# EAGLE design ArmCortexM3_breakout (EAGLE 5.11)
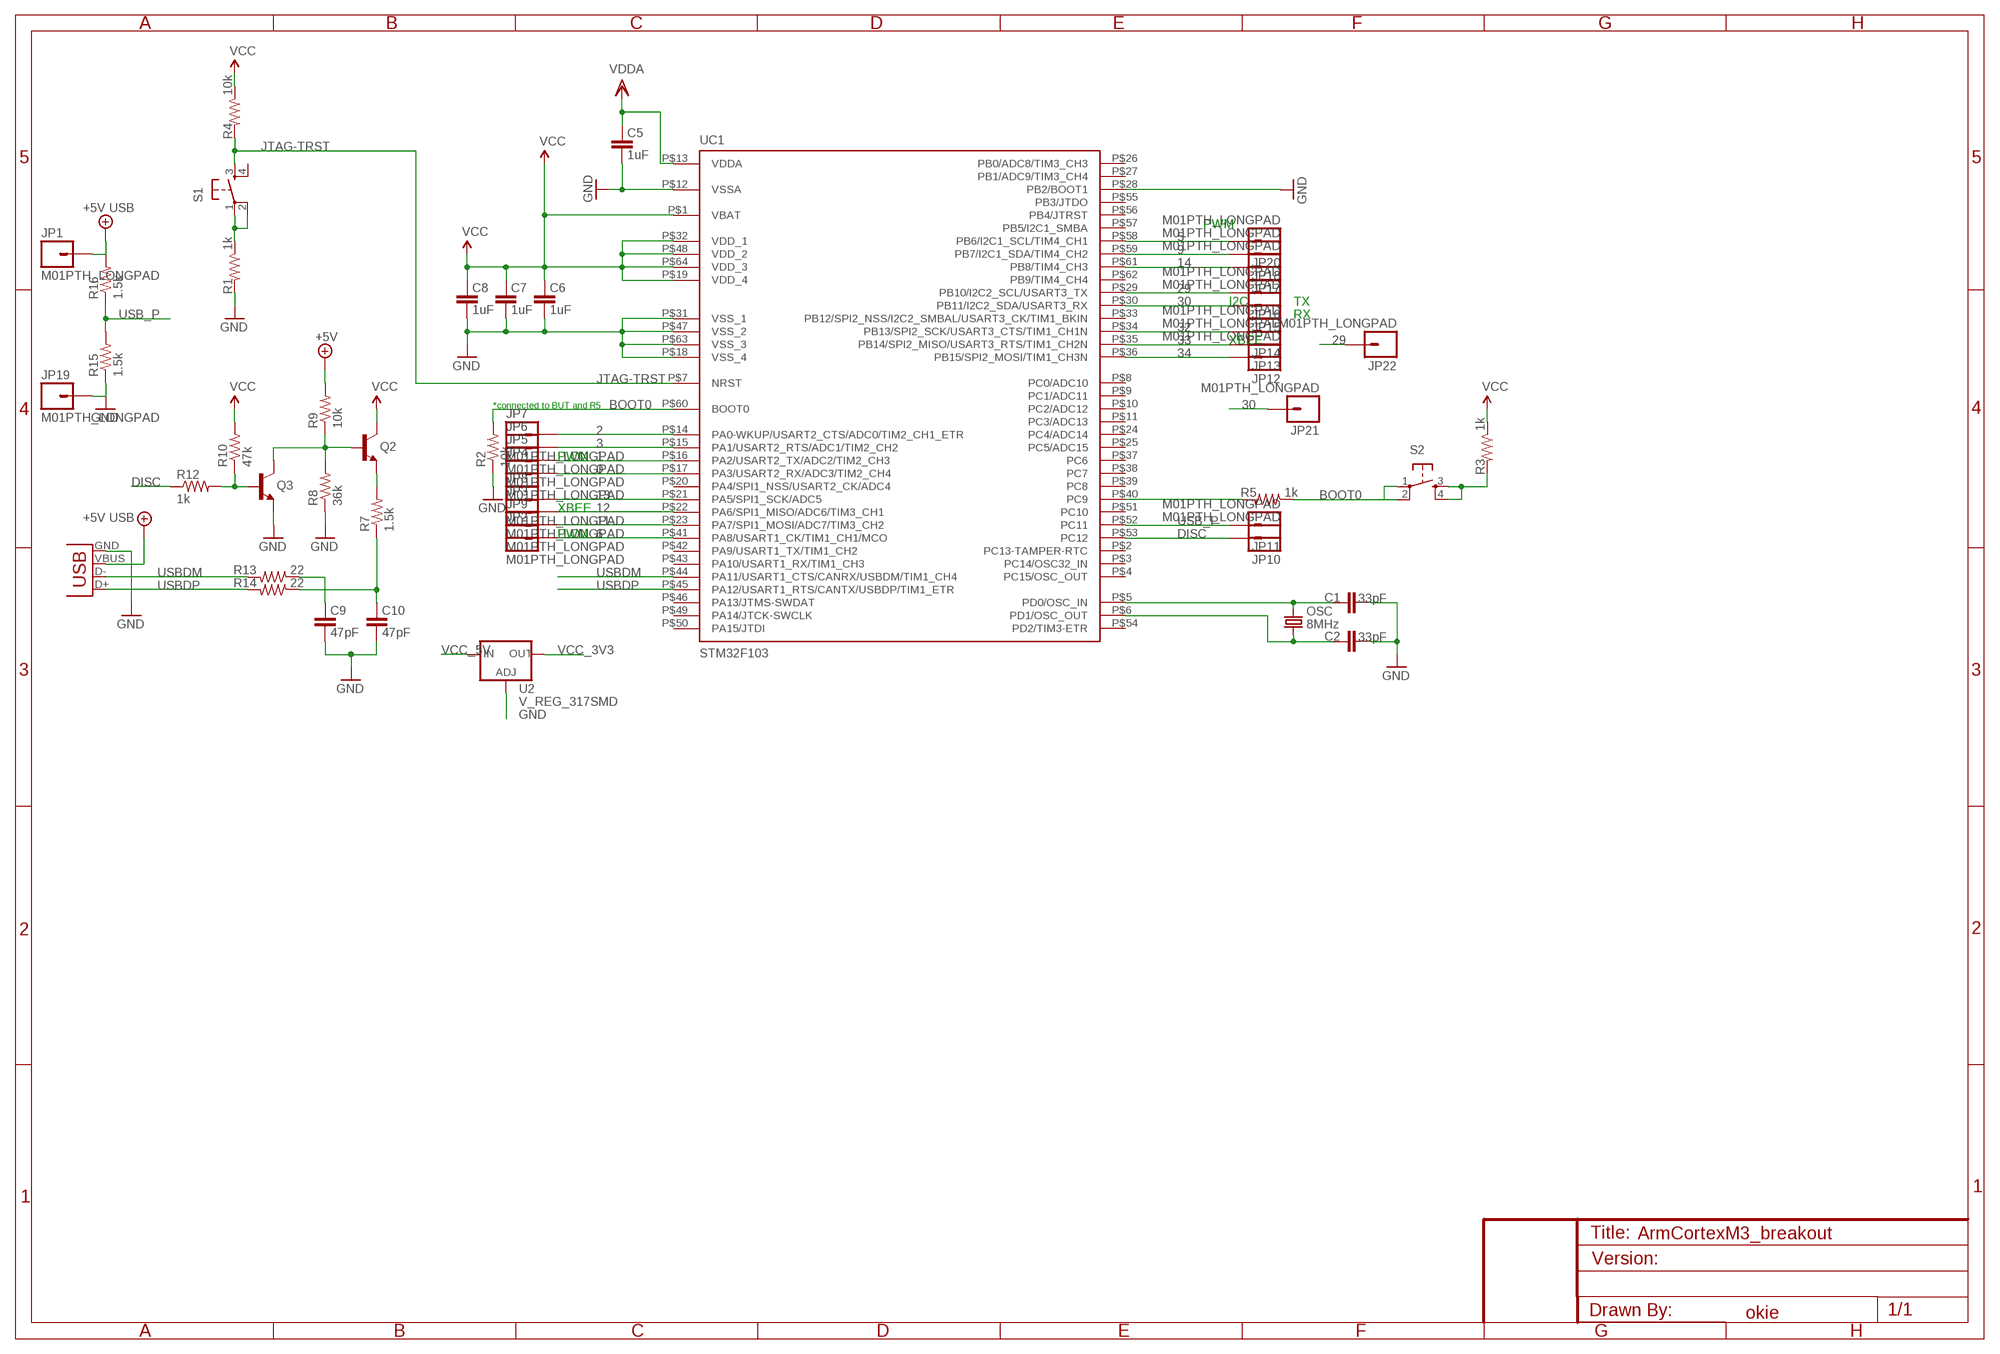
[diagram p0: schematic, sheet 1]

## Parts
C1  33pF  CAP0402  [C0402]
C2  33pF  CAP0402  [C0402]
C5  1uF  CAP0402  [C0402]
C6  1uF  CAP0402  [C0402]
C7  1uF  CAP0402  [C0402]
C8  1uF  CAP0402  [C0402]
C9  47pF  CAP0402  [C0402]
C10  47pF  CAP0402  [C0402]
JP1  M01PTH_LONGPAD  [1X01_LONGPAD]
JP2  M01PTH_LONGPAD  [1X01_LONGPAD]
JP3  M01PTH_LONGPAD  [1X01_LONGPAD]
JP4  M01PTH_LONGPAD  [1X01_LONGPAD]
JP5  M01PTH_LONGPAD  [1X01_LONGPAD]
JP6  M01PTH_LONGPAD  [1X01_LONGPAD]
JP7  M01PTH_LONGPAD  [1X01_LONGPAD]
JP8  M01PTH_LONGPAD  [1X01_LONGPAD]
JP9  M01PTH_LONGPAD  [1X01_LONGPAD]
JP10  M01PTH_LONGPAD  [1X01_LONGPAD]
JP11  M01PTH_LONGPAD  [1X01_LONGPAD]
JP12  M01PTH_LONGPAD  [1X01_LONGPAD]
JP13  M01PTH_LONGPAD  [1X01_LONGPAD]
JP14  M01PTH_LONGPAD  [1X01_LONGPAD]
JP15  M01PTH_LONGPAD  [1X01_LONGPAD]
JP16  M01PTH_LONGPAD  [1X01_LONGPAD]
JP17  M01PTH_LONGPAD  [1X01_LONGPAD]
JP18  M01PTH_LONGPAD  [1X01_LONGPAD]
JP19  M01PTH_LONGPAD  [1X01_LONGPAD]
JP20  M01PTH_LONGPAD  [1X01_LONGPAD]
JP21  M01PTH_LONGPAD  [1X01_LONGPAD]
JP22  M01PTH_LONGPAD  [1X01_LONGPAD]
OSC  8MHz  CRYSTAL5X3  [CRYSTAL-SMD-5X3]
Q2  TRANSISTOR_NPNSOT23  [SOT23]
Q3  TRANSISTOR_NPNSOT23  [SOT23]
R1  1k  RESISTOR0402  [C0402]
R2  10k  RESISTOR0402  [C0402]
R3  1k  RESISTOR0402  [C0402]
R4  10k  RESISTOR0402  [C0402]
R5  1k  RESISTOR0402  [C0402]
R7  1.5k  RESISTOR0402  [C0402]
R8  36k  RESISTOR0402  [C0402]
R9  10k  RESISTOR0402  [C0402]
R10  47k  RESISTOR0402  [C0402]
R12  1k  RESISTOR0402  [C0402]
R13  22  RESISTOR0402  [C0402]
R14  22  RESISTOR0402  [C0402]
R15  1.5k  RESISTOR0402  [C0402]
R16  1.5k  RESISTOR0402  [C0402]
S1  TAC_SWITCHSMD  [TACTILE_SWITCH_SMD]
S2  TAC_SWITCHSMD  [TACTILE_SWITCH_SMD]
U2  V_REG_317SMD  [SOT223]
UC1  STM32F103  [TQFP-10X10-64]
X1  USBSMD  [USB-MINIB]

## Nets
0: JP4.1 UC1.P$17(PA3/USART2_RX/ADC3/TIM2_CH4)
1: JP5.1 UC1.P$16(PA2/USART2_TX/ADC2/TIM2_CH3)
2: JP7.1 UC1.P$14(PA0-WKUP/USART2_CTS/ADC0/TIM2_CH1_ETR)
3: JP6.1 UC1.P$15(PA1/USART2_RTS/ADC1/TIM2_CH2)
5: JP20.1 UC1.P$58(PB6/I2C1_SCL/TIM4_CH1)
6: JP2.1 UC1.P$41(PA8/USART1_CK/TIM1_CH1/MCO)
9: JP18.1 UC1.P$59(PB7/I2C1_SDA/TIM4_CH2)
11: JP9.1 UC1.P$23(PA7/SPI1_MOSI/ADC7/TIM3_CH2)
12: JP3.1 UC1.P$22(PA6/SPI1_MISO/ADC6/TIM3_CH1)
13: JP8.1 UC1.P$21(PA5/SPI1_SCK/ADC5)
14: JP17.1 UC1.P$61(PB8/TIM4_CH3)
29: JP16.1 JP22.1 UC1.P$29(PB10/I2C2_SCL/USART3_TX)
30: JP15.1 JP21.1 UC1.P$30(PB11/I2C2_SDA/USART3_RX)
32: JP14.1 UC1.P$34(PB13/SPI2_SCK/USART3_CTS/TIM1_CH1N)
33: JP13.1 UC1.P$35(PB14/SPI2_MISO/USART3_RTS/TIM1_CH2N)
34: JP12.1 UC1.P$36(PB15/SPI2_MOSI/TIM1_CH3N)
BOOT0: R2.2 R5.1 S2.1 S2.2 UC1.P$60(BOOT0)
DISC: JP10.1 R12.1 UC1.P$53(PC12)
GND [vcc]: C1.1 C2.1 C5.1 C6.1 C7.1 C8.1 C9.1 C10.1 JP19.1 Q3.2(E) R1.2 R2.1 R8.1 R15.1 U2.1(ADJ) UC1.P$12(VSSA) UC1.P$18(VSS_4) UC1.P$28(PB2/BOOT1) UC1.P$31(VSS_1) UC1.P$47(VSS_2) UC1.P$63(VSS_3) X1.GND
JTAG-TRST: R4.2 S1.3 UC1.P$7(NRST)
N$2: C2.2 OSC.1 UC1.P$6(PD1/OSC_OUT)
N$6: C1.2 OSC.3 UC1.P$5(PD0/OSC_IN)
N$8: Q2.2(E) R7.2
N$9: Q2.1(B) Q3.3(C) R8.2 R9.1
N$10: Q3.1(B) R10.1 R12.2
N$11: C9.2 R13.1
N$12: C10.2 R7.1 R14.1
N$25 [vcc]: R1.1 S1.1 S1.2
N$26: R3.2 S2.3 S2.4
N$27: R5.2 UC1.P$40(PC9)
USB_P: JP11.1 R15.2 R16.1 UC1.P$52(PC11)
USBDM: R13.2 UC1.P$44(PA11/USART1_CTS/CANRX/USBDM/TIM1_CH4) X1.D-
USBDP: R14.2 UC1.P$45(PA12/USART1_RTS/CANTX/USBDP/TIM1_ETR) X1.D+
VCC_3V3: C5.2 C6.2 C7.2 C8.2 Q2.3(C) R3.1 R4.1 R10.2 U2.2(OUT) UC1.P$1(VBAT) UC1.P$13(VDDA) UC1.P$19(VDD_4) UC1.P$32(VDD_1) UC1.P$48(VDD_2) UC1.P$64(VDD_3) ; supply symbol labelled VDDA, VCC
VCC_5V: JP1.1 R9.2 R16.2 U2.3(IN) X1.VBUS ; supply symbol labelled +5V, +5V USB
Unconnected: S1.4 UC1.P$2(PC13-TAMPER-RTC) UC1.P$3(PC14/OSC32_IN) UC1.P$4(PC15/OSC_OUT) UC1.P$8(PC0/ADC10) UC1.P$9(PC1/ADC11) UC1.P$10(PC2/ADC12) UC1.P$11(PC3/ADC13) UC1.P$20(PA4/SPI1_NSS/USART2_CK/ADC4) UC1.P$24(PC4/ADC14) UC1.P$25(PC5/ADC15) UC1.P$26(PB0/ADC8/TIM3_CH3) UC1.P$27(PB1/ADC9/TIM3_CH4) UC1.P$33(PB12/SPI2_NSS/I2C2_SMBAL/USART3_CK/TIM1_BKIN) UC1.P$37(PC6) UC1.P$38(PC7) UC1.P$39(PC8) UC1.P$42(PA9/USART1_TX/TIM1_CH2) UC1.P$43(PA10/USART1_RX/TIM1_CH3) UC1.P$46(PA13/JTMS-SWDAT) UC1.P$49(PA14/JTCK-SWCLK) UC1.P$50(PA15/JTDI) UC1.P$51(PC10) UC1.P$54(PD2/TIM3-ETR) UC1.P$55(PB3/JTDO) UC1.P$56(PB4/JTRST) UC1.P$57(PB5/I2C1_SMBA) UC1.P$62(PB9/TIM4_CH4)

## Notes on the sheet
- PWM
- I2C | TX
- RX
- XBEE
- *connected to BUT and R5
- PWM
- XBEE
- PWM
- okie

## Library data of the parts
C1 C2 C5-C10 = SparkFun:CAP: Capacitor Standard 0603 ceramic capacitor, and 0.1" leaded capacitor.
JP1-JP22 = SparkFun:M01: Header 1 Standard 1-pin 0.1" header. Use with straight break away headers (SKU : PRT-00116), right angle break away headers (PRT-00553), swiss pins (PRT-00743), machine pins (PRT-00117), and female headers (PRT-00115).
OSC = SparkFun2:CRYSTAL: Crystals Various standard crystals. Proven footprints. Spark Fun Electronics SKU : COM-00534
Q2 Q3 = SparkFun2:TRANSISTOR_NPN: Transistor NPN BJT configuration in SOT23 package. MMBT2222 is the common NPN we use. Double check BCE configuration again layout.
R1-R5 R7-R10 R12-R16 = SparkFun:RESISTOR: Resistor Basic schematic elements and footprints for 0603, 1206, and PTH 1/10th watt (small) resistors.
S1 S2 = SparkFun:TAC_SWITCH: Momentary Switch Button commonly used for reset or general input. Spark Fun Electronics SKU : COM-00097
U2 = SparkFun:V_REG_317: Voltage Regulator Standard LM317 adjustable voltage regulator. AOI (Adjust Output Input). Google 'LM317 Calculator' for easy to use app to get the two resistor values needed. 240/720 for 5V output. 240/390 for 3.3V output. Spark Fun Electronics SKU : COM-00527
UC1 = st-microelectronics:STM32F103
X1 = SparkFun2:USB: USB Connectors USB-B-PTH is fully proven SKU : PRT-00139 USB-miniB is fully proven SKU : PRT-00587 USB-A-PCB is untested. USB-A-H is throughly reviewed, but untested. Spark Fun Electronics SKU : PRT-00437 USB-B-SMT is throughly reviewed, but untested. Needs silkscreen touching up. USB-A-S has not been used/tested USB-MB-H has not been used/tested

## Net classes
1 vcc: width 0.254 mm
2 gnd: width 0.305 mm, drill 0.508 mm, clearance 0.152 mm
3 usbvcc: width 0.508 mm, drill 0.508 mm, clearance 0.152 mm

## Board
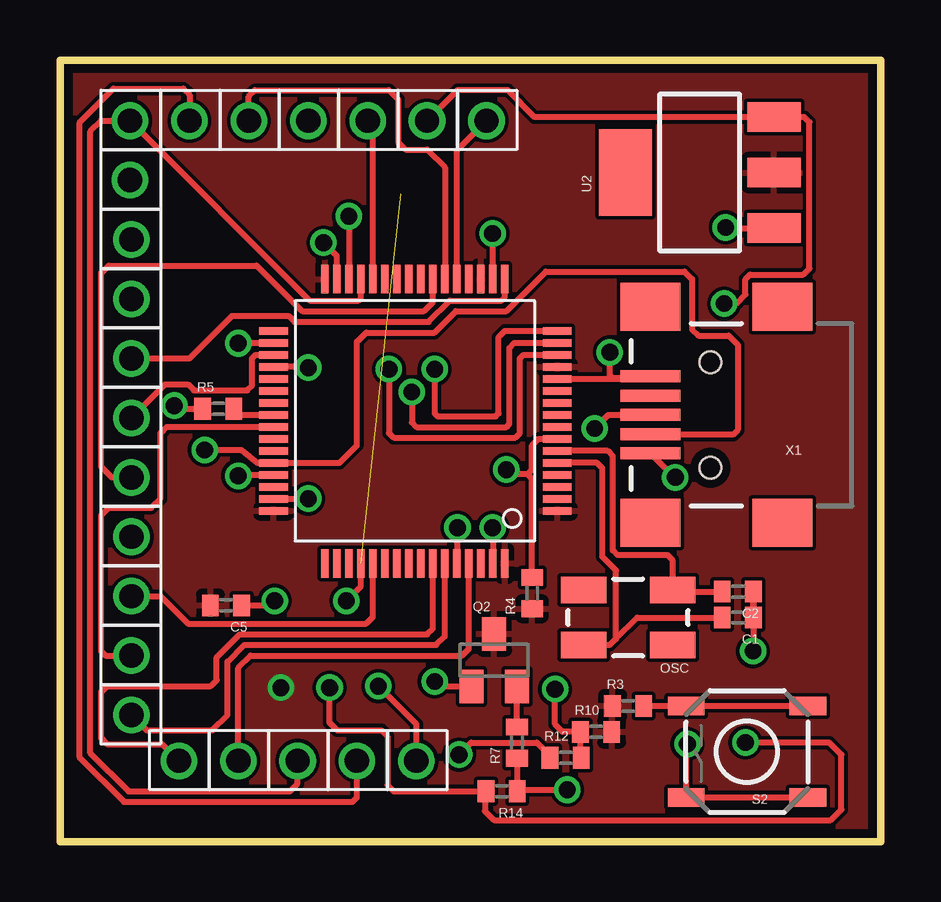
[diagram p1: board, top side]
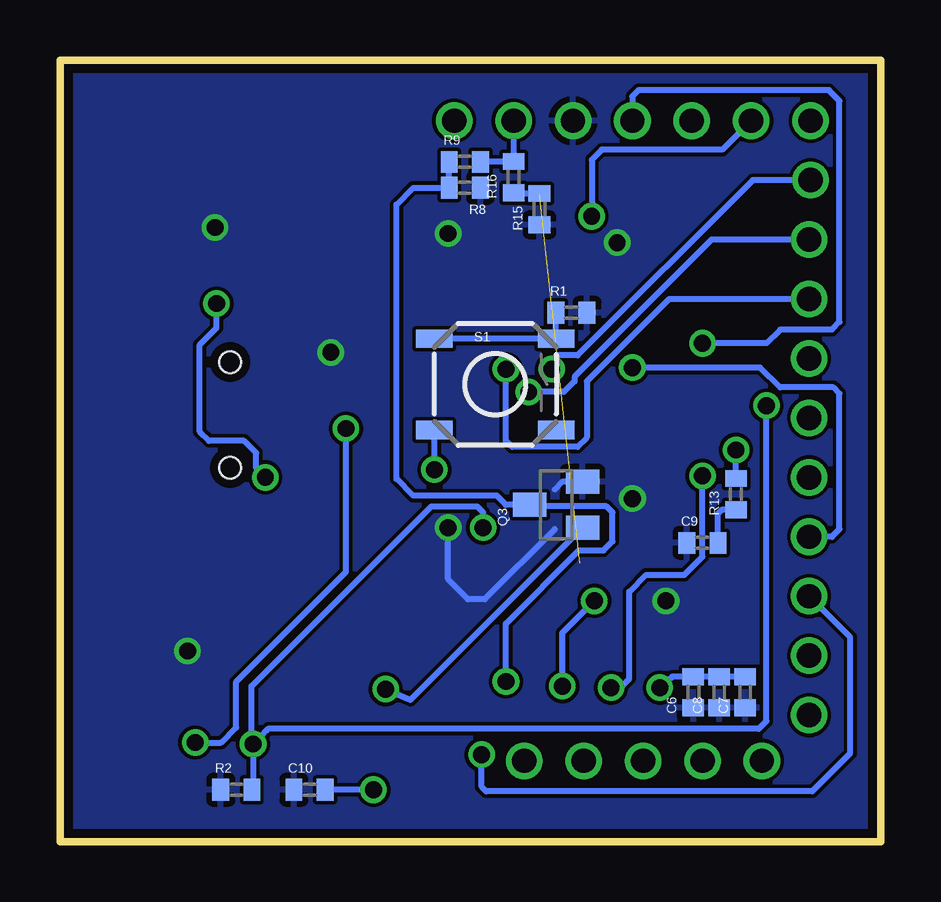
[diagram p2: board, bottom side, seen from below]

Size 34.21 x 32.57 mm. Coordinates in mm from the lower left corner, seen from the top.
Outline: 0,0 34.21,0 34.21,32.57 0,32.57 0,0
Copper layers (1*16): Top 0.0356mm / dielectric 1.5011mm / Bottom 0.0356mm
Design rules "Aerial-2Layer": minimum track width 10mil, minimum drill 15mil, track to track 6mil, track to pad 6mil, pad to pad 6mil, via to via 6mil, smd to smd 6mil, copper to edge 15mil, drill to drill 8mil, minimum pad ring 10mil, minimum via ring 8mil, stop-mask expansion 4mil, vias tented up to drill 0mil, thermal gap 10mil

### Footprints (pad centres in the part's own frame; a part is rotated, then mirrored left to right if it is on the bottom)
C0402 = smd 0.7 x 0.9: 1 -0.65,0; 2 0.65,0
1X01_LONGPAD = drill 1.016 pad 1.524 round: 1 0,0
CRYSTAL-SMD-5X3 = smd 1.9 x 1.1: 1 -1.85,-1.15; 2 1.85,-1.15; 3 1.85,1.15; 4 -1.85,1.15
SOT23 = smd 1 x 1.4: 1 -0.95,-1.1; 2 0.95,-1.1; 3 0,1.1
TACTILE_SWITCH_SMD = smd 1.524 x 0.762: 1 -2.54,1.905; 2 2.54,1.905; 3 -2.54,-1.905; 4 2.54,-1.905
SOT223 = smd 1.219 x 2.235: 1 -2.311,-3.099; 2 0,-3.099; 3 2.311,-3.099 | smd 3.6 x 2.2: 4 0,3.099
TQFP-10X10-64 = smd 1.2 x 0.3: P$1 -5.936,3.75; P$2 -5.936,3.25; P$3 -5.936,2.75; P$4 -5.936,2.25; P$5 -5.936,1.75; P$6 -5.936,1.25; P$7 -5.936,0.75; P$8 -5.936,0.25; P$9 -5.936,-0.25; P$10 -5.936,-0.75; P$11 -5.936,-1.25; P$12 -5.936,-1.75; P$13 -5.936,-2.25; P$14 -5.936,-2.75; P$15 -5.936,-3.25; P$16 -5.936,-3.75; P$33 5.886,-3.75; P$34 5.886,-3.25; P$35 5.886,-2.75; P$36 5.886,-2.25; P$37 5.886,-1.75; P$38 5.886,-1.25; P$39 5.886,-0.75; P$40 5.886,-0.25; P$41 5.886,0.25; P$42 5.886,0.75; P$43 5.886,1.25; P$44 5.886,1.75; P$45 5.886,2.25; P$46 5.886,2.75; P$47 5.886,3.25; P$48 5.886,3.75 | smd 0.3 x 1.2: P$17 -3.75,-5.911; P$18 -3.25,-5.911; P$19 -2.75,-5.911; P$20 -2.25,-5.911; P$21 -1.75,-5.911; P$22 -1.25,-5.911; P$23 -0.75,-5.911; P$24 -0.25,-5.911; P$25 0.25,-5.911; P$26 0.75,-5.911; P$27 1.25,-5.911; P$28 1.75,-5.911; P$29 2.25,-5.911; P$30 2.75,-5.911; P$31 3.25,-5.911; P$32 3.75,-5.911; P$49 3.75,5.936; P$50 3.25,5.936; P$51 2.75,5.936; P$52 2.25,5.936; P$53 1.75,5.936; P$54 1.25,5.936; P$55 0.75,5.936; P$56 0.25,5.936; P$57 -0.25,5.936; P$58 -0.75,5.936; P$59 -1.25,5.936; P$60 -1.75,5.936; P$61 -2.25,5.936; P$62 -2.75,5.936; P$63 -3.25,5.936; P$64 -3.75,5.936
USB-MINIB = smd 2.5 x 0.5: D+ 2.5,0; D- 2.5,0.8; GND 2.5,-1.6; ID 2.5,-0.8; VBUS 2.5,1.6 | smd 2.5 x 2: GND@1 -3,-4.5; GND@2 -3,4.5; GND@3 2.5,4.5; GND@4 2.5,-4.5 | hole 0.9: 0,2.2; 0,-2.2

### Placement (x,y rotation side)
C1  28.26,9.33 180 top
C2  28.26,10.41 180 top
C5  6.92,9.84 180 top
C6  7.81,6.22 90 bottom
C7  5.65,6.22 90 bottom
C8  6.73,6.22 90 bottom
C9  7.43,12.45 0 bottom
C10  23.81,2.16 0 bottom
JP1  15.3,30.04 0 top
JP2  2.98,7.75 90 top
JP3  7.87,30.04 0 top
JP4  2.98,20.13 90 top
JP5  2.98,22.61 90 top
JP6  2.98,25.08 90 top
JP7  2.92,27.56 0 top
JP8  17.78,30.04 0 top
JP9  2.98,15.18 90 top
JP10  2.98,10.22 90 top
JP11  14.86,3.37 0 top
JP12  2.98,12.7 90 top
JP13  2.98,17.65 90 top
JP14  10.35,30.04 0 top
JP15  5.4,30.04 0 top
JP16  2.92,30.04 0 top
JP17  7.43,3.37 0 top
JP18  2.98,5.27 90 top
JP19  12.83,30.04 0 top
JP20  4.95,3.37 0 top
JP21  12.38,3.37 0 top
JP22  9.91,3.37 0 top
OSC  23.69,9.33 180 top
Q2  18.1,7.56 0 top
Q3  13.53,14.03 90 bottom
R1  12.89,22.03 0 bottom
R2  26.86,2.16 0 bottom
R3  23.69,5.65 0 top
R4  19.68,10.35 90 top
R5  6.6,18.03 0 top
R7  19.05,4.13 90 top
R8  17.34,27.24 180 bottom
R9  17.34,28.32 0 bottom
R10  22.35,4.57 0 top
R12  21.08,3.49 0 top
R13  6.03,14.48 90 bottom
R14  18.41,2.1 180 top
R15  14.22,26.35 90 bottom
R16  15.3,27.69 90 bottom
S1  16.07,19.05 0 bottom
S2  28.64,3.75 180 top
U2  26.67,27.88 90 top
UC1  14.8,17.53 180 top
X1  27.11,17.78 180 top

### Tracks (layer width: path | path; a pad name or v marks a point on that pad's centre or on a via)
0
  Top 0.254: JP4.1 5.4,20.13 7.18,21.91 9.53,21.91 9.78,21.65 15.37,21.65 16.26,22.54 18.41,22.54 18.55,22.67 UC1.P$17
1  (via drill 0.7)
  Top 0.254: UC1.P$16 18.55,21.28 18.29,21.02 18.29,17.84 18.16,17.72 15.75,17.72 15.62,17.84 v15.62,19.68
  Bottom 0.254: v15.62,19.68 15.62,16.7 15.37,16.45 12.64,16.45 12.26,16.83 12.26,19.18 8.83,22.61 JP5.1
2  (via drill 0.7)
  Top 0.254: UC1.P$14 19.32,20.28 19.18,20.13 19.18,17.02 18.99,16.83 13.91,16.83 13.72,17.02 v13.72,19.68
  Bottom 0.254: v13.72,19.68 13.72,20.07 13.53,20.26 12.64,20.26 5.33,27.56 JP7.1
3  (via drill 0.7)
  Top 0.254: UC1.P$15 18.93,20.78 18.73,20.57 18.73,17.4 18.61,17.27 14.86,17.27 14.67,17.46 v14.67,18.73
  Bottom 0.254: v14.67,18.73 13.21,18.73 12.76,19.18 12.76,19.37 7.05,25.08 JP6.1
5
  Top 0.254: UC1.P$58 15.55,8.88 15.3,8.64 7.49,8.64 6.54,7.68 6.54,6.73 6.29,6.48 1.97,6.48 1.71,6.22 1.71,4.32 1.97,4.06 4.25,4.06 JP20.1
6
  Top 0.254: UC1.P$41 4.45,17.28 4.19,17.02 4.19,14.29 3.81,13.91 2.03,13.91 1.71,13.59 1.71,7.94 1.91,7.75 JP2.1
9
  Top 0.254: UC1.P$59 16.05,8.55 15.68,8.19 7.68,8.19 6.99,7.49 6.99,5.27 6.35,4.64 3.62,4.64 JP18.1
11
  Top 0.254: UC1.P$23 15.55,22.47 15.18,22.1 10.1,22.1 8.19,24 2.03,24 1.71,23.69 1.71,15.62 2.16,15.18 JP9.1
12
  Top 0.254: UC1.P$22 16.05,28.09 15.3,28.83 14.41,28.83 14.1,29.15 14.1,30.92 13.72,31.3 8.13,31.3 7.87,31.05 JP3.1
13
  Top 0.254: UC1.P$21 16.55,28.8 JP8.1
14
  Top 0.254: UC1.P$61 17.05,8.03 16.76,7.75 7.94,7.75 7.43,7.24 JP17.1
29
  Top 0.254: UC1.P$29 12.55,22.64 12.45,22.54 10.41,22.54 JP16.1 1.71,30.04 1.27,29.59 1.27,3.68 2.86,2.1 9.59,2.1 9.91,2.41 JP22.1
30  (via drill 0.7)
  Top 0.254: v12.05,26.05 UC1.P$30 | JP21.1 12.38,1.84 12.19,1.65 2.67,1.65 0.83,3.49 0.83,29.97 2.22,31.37 5.14,31.37 5.4,31.11 JP15.1
  Bottom 0.254: v12.05,26.05 12.05,28.4 11.62,28.83 6.6,28.83 JP15.1
32  (via drill 0.7)
  Top 0.254: UC1.P$34 7.44,20.78 v7.43,20.77
  Bottom 0.254: v7.43,20.77 4.76,20.77 4.19,21.34 2.03,21.34 1.71,21.65 1.71,30.86 2.16,31.3 10.1,31.3 10.35,31.05 JP14.1
33
  Top 0.254: UC1.P$35 8.15,20.28 8,20.13 8,18.99 7.81,18.8 5.59,18.8 5.33,19.05 4.38,19.05 JP13.1
34  (via drill 0.7)
  Top 0.254: UC1.P$36 10.32,19.78 v10.35,19.75
  Bottom 0.254: v10.35,19.75 5.02,19.75 4.19,18.92 1.97,18.92 1.71,18.67 1.71,13.02 2.03,12.7 JP12.1
BOOT0  (via drill 0.7)
  Top 0.254: S2.1 S2.2 26.1,4 v26.16,4.06 | UC1.P$60 16.55,13.05 v16.57,13.08 | R5.1 4.89,18.03 v4.76,18.16
  Bottom 0.254: v26.16,4.06 26.16,2.21 R2.2 | v26.16,4.06 25.81,4.41 25.59,4.64 25.53,4.7 5.08,4.7 4.76,5.02 v4.76,18.16 | v16.57,13.08 16.57,13.72 16.83,13.97 18.73,13.97 26.23,6.48 26.23,4.13 v26.16,4.06
DISC  (via drill 0.7)
  Top 0.254: UC1.P$53 13.05,9.36 12.76,9.08 5.33,9.08 4.19,10.22 JP10.1 | R12.1 20.43,3.57 19.88,4.13 17.14,4.13 v16.64,3.62
  Bottom 0.254: v16.64,3.62 16.64,2.29 16.45,2.1 2.86,2.1 1.27,3.68 1.27,8.51 JP10.1
GND  (via drill 0.7)
  Top 0.254: UC1.P$12 24.51,19.28 X1.GND | UC1.P$28 13.05,29.82 JP19.1 | X1.GND 24.63,19.37 | C1.1 C2.1 28.91,7.95 v28.89,7.94 | C5.1 8.76,9.84 v8.95,10.03 | UC1.P$47 10.34,14.28 v10.35,14.29 | UC1.P$31 11.55,24.39 v10.99,24.96 | UC1.P$18 18.05,24.88 v18.03,25.34 | X1.GND 23.51,19.38 23.43,19.3 23.05,19.3 22.92,19.43 v22.92,20.38 | U2.1 27.77,25.57 v27.75,25.59 | UC1.P$63 18.05,13.07 v18.03,13.08
  Bottom 0.254: v28.89,7.94 28.89,7.87 | v10.35,14.29 10.41,14.29 | v10.99,24.96 10.92,24.96 | v27.75,25.59 27.69,25.65 | v18.03,13.08 18.03,10.92 17.21,10.1 16.51,10.1 13.59,13.02 | 12.43,15.37 Q3.2 13.27,14.99 13.59,14.67
  pour Bottom: -0.51,33.02 34.86,33.02 34.86,-0.7 -0.51,-0.7
JTAG-TRST  (via drill 0.7)
  Top 0.254: UC1.P$7 19.95,16.78 19.68,16.51 19.68,15.49 19.49,15.3 | 19.49,15.3 18.8,15.3 v18.61,15.49 | 19.49,15.3 19.68,15.11 R4.2
  Bottom 0.254: v18.61,15.49 S1.3
N$2
  Top 0.254: UC1.P$6 22.84,16.28 23.05,16.07 23.05,12.13 23.24,11.94 25.34,11.94 25.53,11.75 25.53,10.49 OSC.1 25.61,10.41 C2.2
N$6
  Top 0.254: UC1.P$5 22.39,15.78 22.61,15.56 22.61,11.87 23.18,11.3 23.18,8.45 | 23.18,8.45 22.92,8.19 21.84,8.19 OSC.3 | C1.2 24.07,9.34 23.18,8.45
N$8
  Top 0.254: R7.2 19.05,6.35 Q2.2
N$9  (via drill 0.7)
  Top 0.254: Q2.1 15.83,6.46 v15.62,6.67
  Bottom 0.254: R9.1 R8.2 19.49,27.24 20.19,26.54 20.19,15.11 19.49,14.41 16,14.41 15.62,14.03 Q3.3 14.56,13.97 11.43,13.97 11.18,13.72 11.18,12.51 11.56,12.13 12.57,12.13 15.62,9.08 v15.62,6.67
N$10  (via drill 0.7)
  Top 0.254: R12.2 21.7,3.52 R10.1 20.95,4.57 20.64,4.89 v20.64,6.35
  Bottom 0.254: v20.64,6.35 19.6,5.91 Q3.1
N$11
  Bottom 0.254: C9.2 6.78,13.67 6.6,13.84 6.05,13.84 R13.1
N$12  (via drill 0.7)
  Top 0.254: R7.1 19.07,3.46 R14.1 19.13,2.16 v21.14,2.16
  Bottom 0.254: v21.14,2.16 C10.2
N$25
  Bottom 0.254: S1.1 S1.2 R1.1
N$26
  Top 0.254: S2.3 S2.4 R3.2
N$27
  Top 0.254: UC1.P$40 7.51,17.78 R5.2
USB_P  (via drill 0.7)  (1 unrouted)
  Top 0.254: UC1.P$52 12.55,10.64 v11.94,10.03 | JP11.1 14.86,4.89 v13.27,6.48
  Bottom 0.254: R15.2 15.27,27 R16.1 | v13.27,6.48 13.27,8.7 v11.94,10.03
USBDM  (via drill 0.7)
  Top 0.254: v6.03,16.32 7.56,16.32 8.23,15.78 UC1.P$44 11.65,15.78 12.38,16.51 12.38,20.83 12.76,21.21 15.62,21.21 16.51,22.1 18.61,22.1 20.26,23.75 26.04,23.75 26.35,23.43 26.35,21.34 26.61,21.08 27.88,21.08 28.26,20.7 28.26,17.14 28.07,16.95 24.64,16.95 X1.D-
  Bottom 0.254: R13.2 v6.03,16.32
USBDP  (via drill 0.7)
  Top 0.254: UC1.P$45 7.46,15.28 v7.43,15.24 | v11.24,6.41 11.24,4.95 11.56,4.64 13.4,4.64 13.65,4.38 13.65,2.35 13.91,2.1 R14.2 17.72,2.05 17.72,1.27 18.1,0.89 32.13,0.89 32.58,1.33 32.58,3.62 32.07,4.13 v28.57,4.13 | X1.D+ 22.86,17.78 v22.29,17.21
  Bottom 0.254: v7.43,15.24 7.43,11.87 8.19,11.11 9.78,11.11 10.48,10.41 10.48,6.79 10.86,6.41 v11.24,6.41 | v22.29,17.21 22.29,11.24 26.86,6.67 26.86,4.76 27.5,4.13 v28.57,4.13
VCC_3V3  (via drill 0.7)
  Top 0.254: R3.1 23,5.62 | Q2.3 18.12,8.64
  Bottom 0.254: C7.2 5.73,6.87 | C8.2 C6.2 | C8.2 8.68,6.87 v9.21,6.41 | 5.73,6.87 5.65,6.79 | 5.73,6.87 C8.2
  pour Top: -0.89,33.34 35.37,33.34 35.37,-1.14 -0.89,-1.14
VCC_5V  (via drill 0.7)
  Top 0.254: 24.63,16.19 X1.VBUS 25.62,15.18 v25.65,15.18 | JP1.1 16.57,31.3 18.67,31.3 19.79,30.19 U2.3 31.03,30.19 31.24,29.97 31.24,23.88 30.99,23.62 28.77,23.62 28.57,23.43 28.57,22.8 28.19,22.42 v27.69,22.42
  Bottom 0.254: R9.2 16.67,28.34 R16.2 JP1.1 | v27.69,22.42 27.69,21.4 28.38,20.7 28.38,17.08 28,16.7 26.54,16.7 26.04,16.19 26.04,15.56 v25.65,15.18